# EAGLE design DoE Receiver v1_16 (EAGLE 9.5.2)
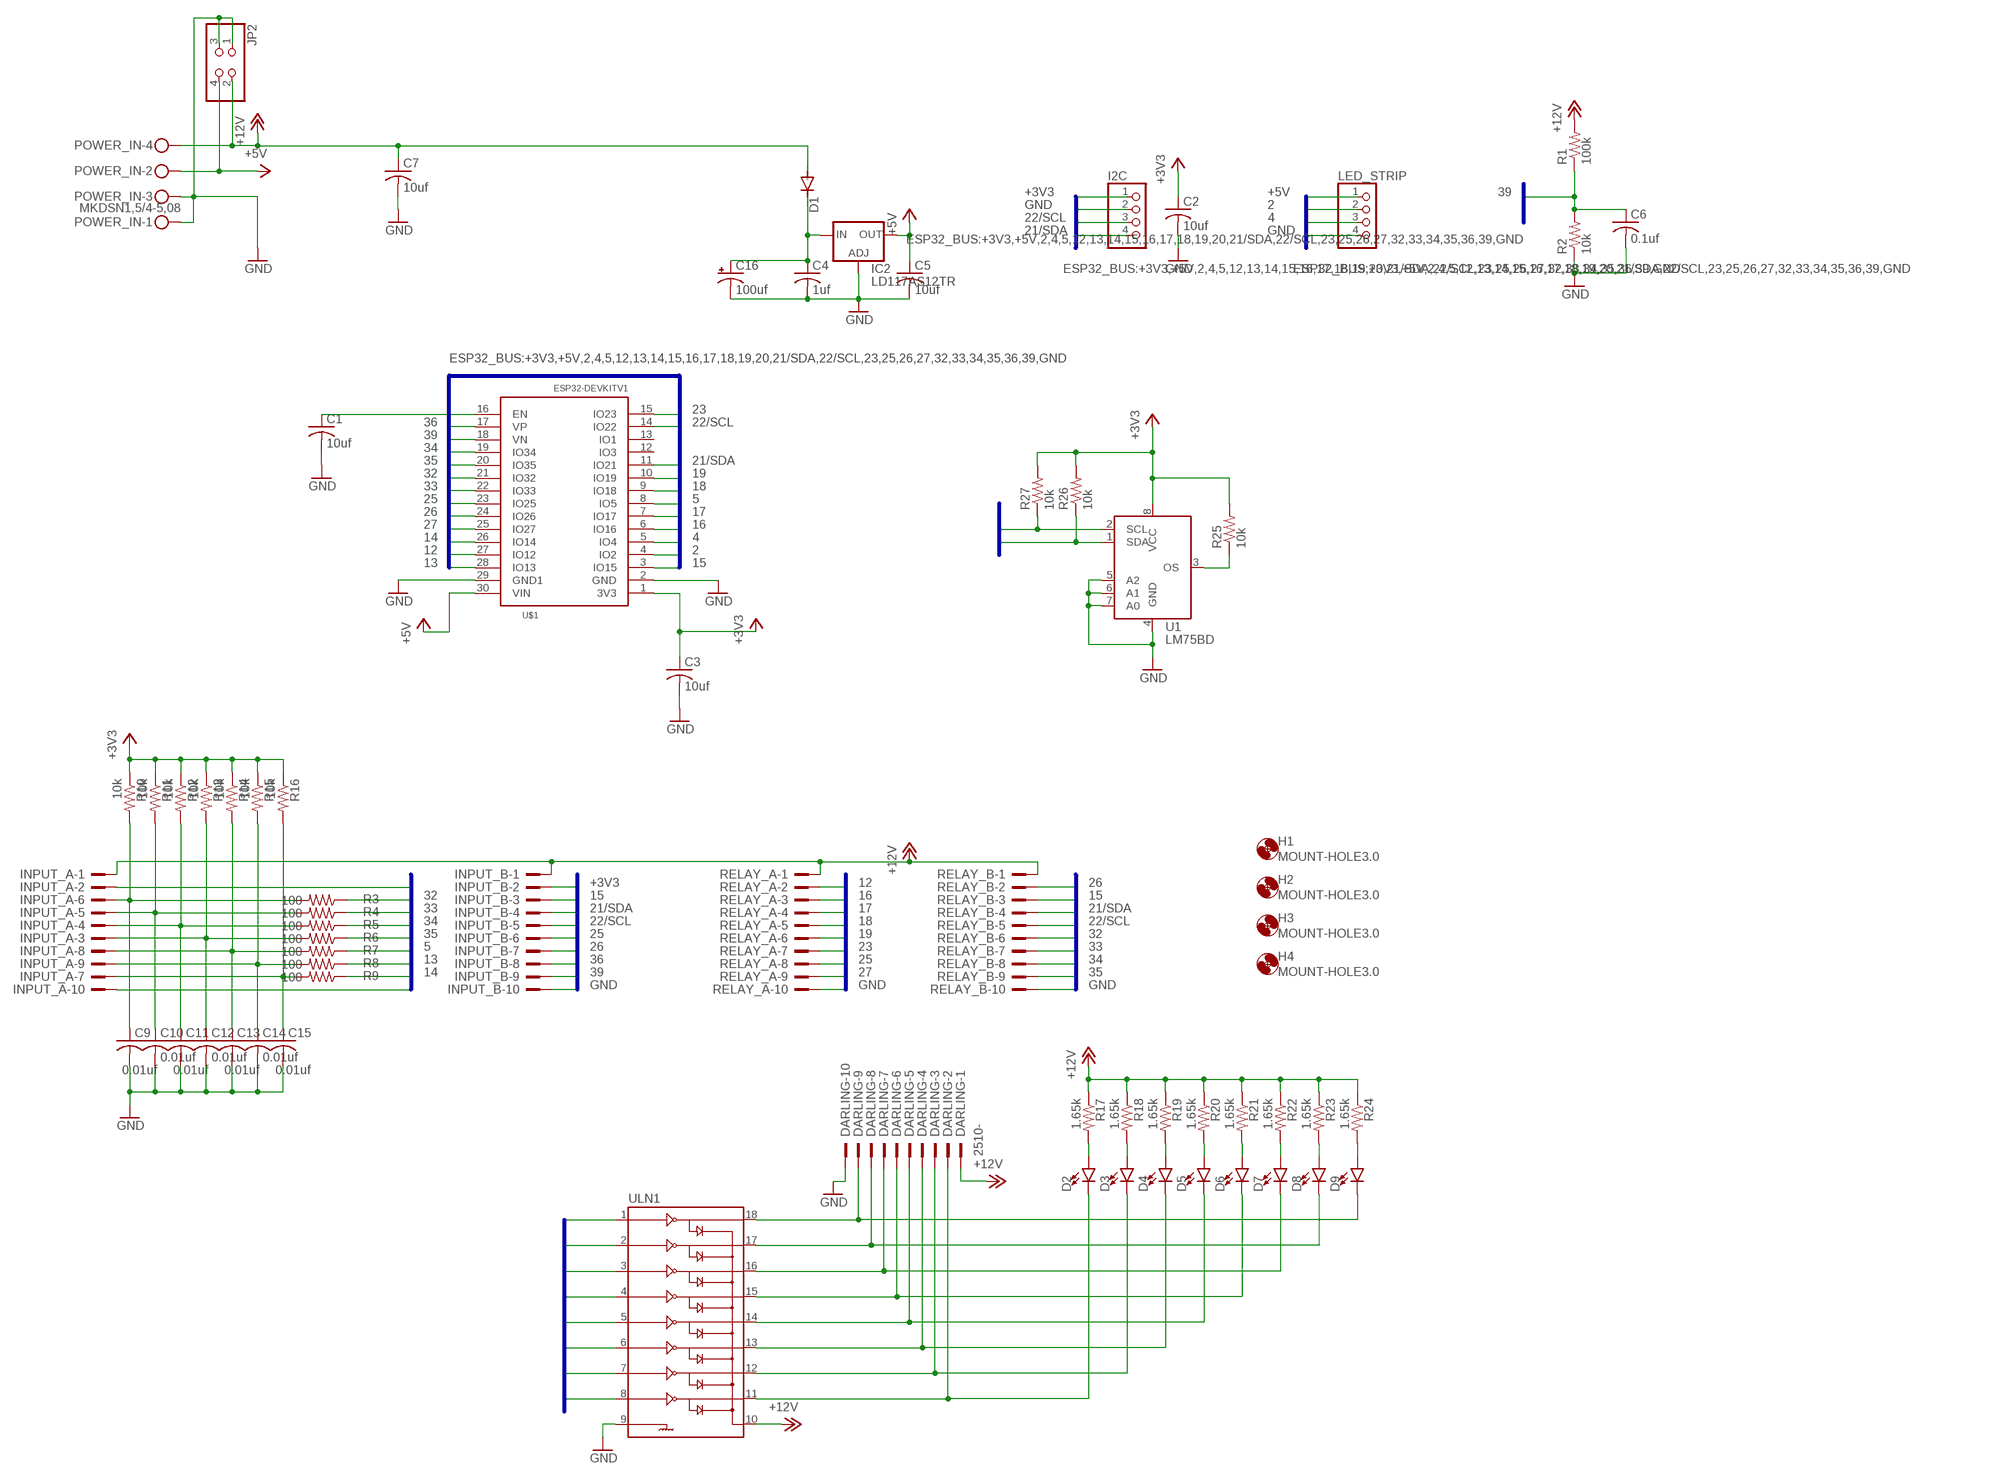
[diagram p0: schematic, sheet 1]

## Parts
C1  10uf  C-USC0603  [C0603]
C2  10uf  C-USC0603  [C0603]
C3  10uf  C-USC0603  [C0603]
C4  1uf  C-USC0805  [C0805]
C5  10uf  C-USC0603  [C0603]
C6  0.1uf  C-USC0603  [C0603]
C7  10uf  C-USC0805  [C0805]
C9  0.01uf  C-USC0603  [C0603]
C10  0.01uf  C-USC0603  [C0603]
C11  0.01uf  C-USC0603  [C0603]
C12  0.01uf  C-USC0603  [C0603]
C13  0.01uf  C-USC0603  [C0603]
C14  0.01uf  C-USC0603  [C0603]
C15  0.01uf  C-USC0603  [C0603]
C16  100uf  CPOL-US153CLV-0807  [153CLV-0807]
D1  DIODE-DO-214AC  [DO-214AC]
D2  LED0603  [LED-0603]
D3  LED0603  [LED-0603]
D4  LED0603  [LED-0603]
D5  LED0603  [LED-0603]
D6  LED0603  [LED-0603]
D7  LED0603  [LED-0603]
D8  LED0603  [LED-0603]
D9  LED0603  [LED-0603]
DARLING  2510-  [PAK100/2500-10]
H1  MOUNT-HOLE3.0  [3,0]
H2  MOUNT-HOLE3.0  [3,0]
H3  MOUNT-HOLE3.0  [3,0]
H4  MOUNT-HOLE3.0  [3,0]
I2C  PINHD-1X4  [1X04]
IC2  LD117AS12TR  [SOT223]
INPUT_A  2510-  [PAK100/2500-10]
INPUT_B  2510-  [PAK100/2500-10]
JP2  PINHD-2X2  [2X02]
LED_STRIP  PINHD-1X4/90  [1X04/90]
POWER_IN  MKDSN1,5/4-5,08  [MKDSN1,5/4-5,08]
R1  100k  R-US_R0603  [R0603]
R2  10k  R-US_R0603  [R0603]
R3  100  R-US_R0603  [R0603]
R4  100  R-US_R0603  [R0603]
R5  100  R-US_R0603  [R0603]
R6  100  R-US_R0603  [R0603]
R7  100  R-US_R0603  [R0603]
R8  100  R-US_R0603  [R0603]
R9  100  R-US_R0603  [R0603]
R10  10k  R-US_R0603  [R0603]
R11  10k  R-US_R0603  [R0603]
R12  10k  R-US_R0603  [R0603]
R13  10k  R-US_R0603  [R0603]
R14  10k  R-US_R0603  [R0603]
R15  10k  R-US_R0603  [R0603]
R16  10k  R-US_R0603  [R0603]
R17  1.65k  R-US_R0603  [R0603]
R18  1.65k  R-US_R0603  [R0603]
R19  1.65k  R-US_R0603  [R0603]
R20  1.65k  R-US_R0603  [R0603]
R21  1.65k  R-US_R0603  [R0603]
R22  1.65k  R-US_R0603  [R0603]
R23  1.65k  R-US_R0603  [R0603]
R24  1.65k  R-US_R0603  [R0603]
R25  10k  R-US_R0603  [R0603]
R26  10k  R-US_R0603  [R0603]
R27  10k  R-US_R0603  [R0603]
RELAY_A  2510-  [PAK100/2500-10]
RELAY_B  2510-  [PAK100/2500-10]
U1  LM75BD  [SOT96-1]
U$1  ESP32DEVKITV1  [ESP32-DEVKITV1]
ULN1  ULN2803SOIC  [SO018]

## Nets
2: LED_STRIP.2 U$1.4(IO2)
4: LED_STRIP.3 U$1.5(IO4)
5: R7.1 U$1.8(IO5)
12: RELAY_A.2 U$1.27(IO12) ULN1.8
13: R8.1 U$1.28(IO13)
14: R9.1 U$1.26(IO14)
15: INPUT_B.3 RELAY_B.3 U$1.3(IO15)
16: RELAY_A.3 U$1.6(IO16) ULN1.7
17: RELAY_A.4 U$1.7(IO17) ULN1.6
18: RELAY_A.5 U$1.9(IO18) ULN1.5
19: RELAY_A.6 U$1.10(IO19) ULN1.4
21/SDA: I2C.4 INPUT_B.4 R26.1 RELAY_B.4 U1.1(SDA) U$1.11(IO21)
22/SCL: I2C.3 INPUT_B.5 R27.1 RELAY_B.5 U1.2(SCL) U$1.14(IO22)
23: RELAY_A.7 U$1.15(IO23) ULN1.3
25: INPUT_B.6 RELAY_A.8 U$1.23(IO25) ULN1.2
26: INPUT_B.7 RELAY_B.2 U$1.24(IO26)
27: RELAY_A.9 U$1.25(IO27) ULN1.1
32: R3.1 RELAY_B.6 U$1.21(IO32)
33: R4.1 RELAY_B.7 U$1.22(IO33)
34: R5.1 RELAY_B.8 U$1.19(IO34)
35: R6.1 RELAY_B.9 U$1.20(IO35)
36: INPUT_B.8 U$1.17(VP)
39: C6.1 INPUT_B.9 R1.1 R2.2 U$1.18(VN)
+3V3 [3V3]: C2.1 C3.1 I2C.1 INPUT_A.2 INPUT_B.2 R10.1 R11.1 R12.1 R13.1 R14.1 R15.1 R16.1 R25.2 R26.2 R27.2 U1.8(VCC) U$1.1(3V3)
+5V [5V]: C5.1 IC2.4(OUT) JP2.4 LED_STRIP.1 POWER_IN.2 U$1.30(VIN)
+12V [12V]: C7.1 D1.A DARLING.1 INPUT_A.1 INPUT_B.1 JP2.2 POWER_IN.4 R1.2 R17.1 R18.1 R19.1 R20.1 R21.1 R22.1 R23.1 R24.1 RELAY_A.1 RELAY_B.1 ULN1.10
GND [GND]: C1.2 C2.2 C3.2 C4.2 C5.2 C6.2 C7.2 C9.2 C10.2 C11.2 C12.2 C13.2 C14.2 C15.2 C16.- DARLING.10 I2C.2 IC2.1(ADJ) INPUT_A.10 INPUT_B.10 JP2.1 JP2.3 LED_STRIP.4 POWER_IN.1 POWER_IN.3 R2.1 RELAY_A.10 RELAY_B.10 U1.4(GND) U1.5(A2) U1.6(A1) U1.7(A0) U$1.2(GND) U$1.29(GND1) ULN1.9
N$1: C1.1 U$1.16(EN)
N$2 [12V]: C4.1 C16.+ D1.C IC2.3(IN)
N$3: C9.1 INPUT_A.6 R3.2 R10.2
N$4: C10.1 INPUT_A.5 R4.2 R11.2
N$5: C11.1 INPUT_A.4 R5.2 R12.2
N$6: C12.1 INPUT_A.3 R6.2 R13.2
N$7: C13.1 INPUT_A.8 R7.2 R14.2
N$8: C14.1 INPUT_A.9 R8.2 R15.2
N$9: C15.1 INPUT_A.7 R9.2 R16.2
N$10: D9.C DARLING.9 ULN1.18
N$11: D8.C DARLING.8 ULN1.17
N$12: D7.C DARLING.7 ULN1.16
N$13: D6.C DARLING.6 ULN1.15
N$14: D5.C DARLING.5 ULN1.14
N$15: D4.C DARLING.4 ULN1.13
N$16: D3.C DARLING.3 ULN1.12
N$17: D2.C DARLING.2 ULN1.11
N$18: D2.A R17.2
N$19: D3.A R18.2
N$20: D4.A R19.2
N$21: D5.A R20.2
N$22: D6.A R21.2
N$23: D7.A R22.2
N$24: D8.A R23.2
N$25: D9.A R24.2
N$26: R25.1 U1.3(OS)
Unconnected: U$1.12(IO3) U$1.13(IO1)

## Buses
ESP32_BUS:+3V3,+5V,2,4,5,12,13,14,15,16,17,18,19,20,21/SDA,22/SCL,23,25,26,27,32,33,34,35,36,39,GND

## Library data of the parts
C1-C3 C5 C7 = rcl:C-US: CAPACITOR, American symbol; LCSC_PART_NUMBER: C19702; SPICEPREFIX: C
C4 = rcl:C-US: CAPACITOR, American symbol; LCSC_PART_NUMBER: C15849; SPICEPREFIX: C
C6 = rcl:C-US: CAPACITOR, American symbol; LCSC_PART_NUMBER: C14663; SPICEPREFIX: C
C9-C15 = rcl:C-US: CAPACITOR, American symbol; LCSC_PART_NUMBER: C57112; SPICEPREFIX: C
C16 = rcl:CPOL-US: POLARIZED CAPACITOR, American symbol; LCSC_PART_NUMBER: C249469; SPICEPREFIX: C
D1 = diode:DIODE-: DIODE; LCSC_PART_NUMBER: C95872
D2-D9 = SparkFun-LED:LED: LED (Generic) Standard schematic elements and footprints for 5mm, 3mm, 1206, and 0603 sized LEDs. Generic LEDs with no color specified.; LCSC_PART_NUMBER: C40378
DARLING INPUT_A INPUT_B RELAY_A RELAY_B = con-3m:2510-: 3M (TM) Pak 100 4-Wall Header Source: 3M; MF: 3M; MPN: 2510-6002UB; OC_FARNELL: 9838244; OC_NEWARK: 46F4725
H1-H4 = holes:MOUNT-HOLE: MOUNTING HOLE with drill center marker
I2C LED_STRIP = pinhead:PINHD-1X4: PIN HEADER
IC2 = v-reg:LD117A?*: Low drop fixed and adjustable positive voltage regulators 1 A Source: http://www.st.com/stonline/products/literature/ds/7194/ld1117axx.pdf; LCSC_PART_NUMBER: C6187; PRICE: 0.5
JP2 = pinhead:PINHD-2X2: PIN HEADER
POWER_IN = con-phoenix-508:MKDSN1,5/4-5,08: MKDSN 1,5/ 4-5,08 Printklemme Nennstrom: 13,5 A Nennspannung: 250 V Rastermaß: 5,08 mm Polzahl: 4 Anschlussart: Schraubanschluss Montage: Löten Anschlussrichtung Leiter/Platine: 0 ° Artikelnummer: 1729144 Source: http://eshop.phoenixcontact.com .. 1729144.pdf
R1 = rcl:R-US_: RESISTOR, American symbol; LCSC_PART_NUMBER: C25803; SPICEPREFIX: R
R2 R10-R16 R25-R27 = rcl:R-US_: RESISTOR, American symbol; LCSC_PART_NUMBER: C25804; SPICEPREFIX: R
R3-R9 = rcl:R-US_: RESISTOR, American symbol; LCSC_PART_NUMBER: C22775; SPICEPREFIX: R
R17-R24 = rcl:R-US_: RESISTOR, American symbol; LCSC_PART_NUMBER: C4177; SPICEPREFIX: R
U1 = nxp_60_1_1:LM75B: Digital temperature sensor and thermal watchdog AAL Eindhoven MK; LCSC_PART_NUMBER: C34565
U$1 = ESP32-DEVKITV1:ESP32DEVKITV1
ULN1 = SparkFun-PowerIC:ULN2803: Darlington Driver ULN2803 Darlington array. 500mA max per channel, 8-channel package. Spark Fun Electronics SKU : COM-00312; LCSC_PART_NUMBER: C9683

## Net classes
0 default: width 0.254 mm, clearance 0.203 mm
1 GND: width 0.508 mm, clearance 0.203 mm
2 12V: width 1.27 mm, clearance 0.254 mm
3 5V: width 0.635 mm, clearance 0.203 mm
4 3V3: width 0.305 mm, clearance 0.203 mm

## Board
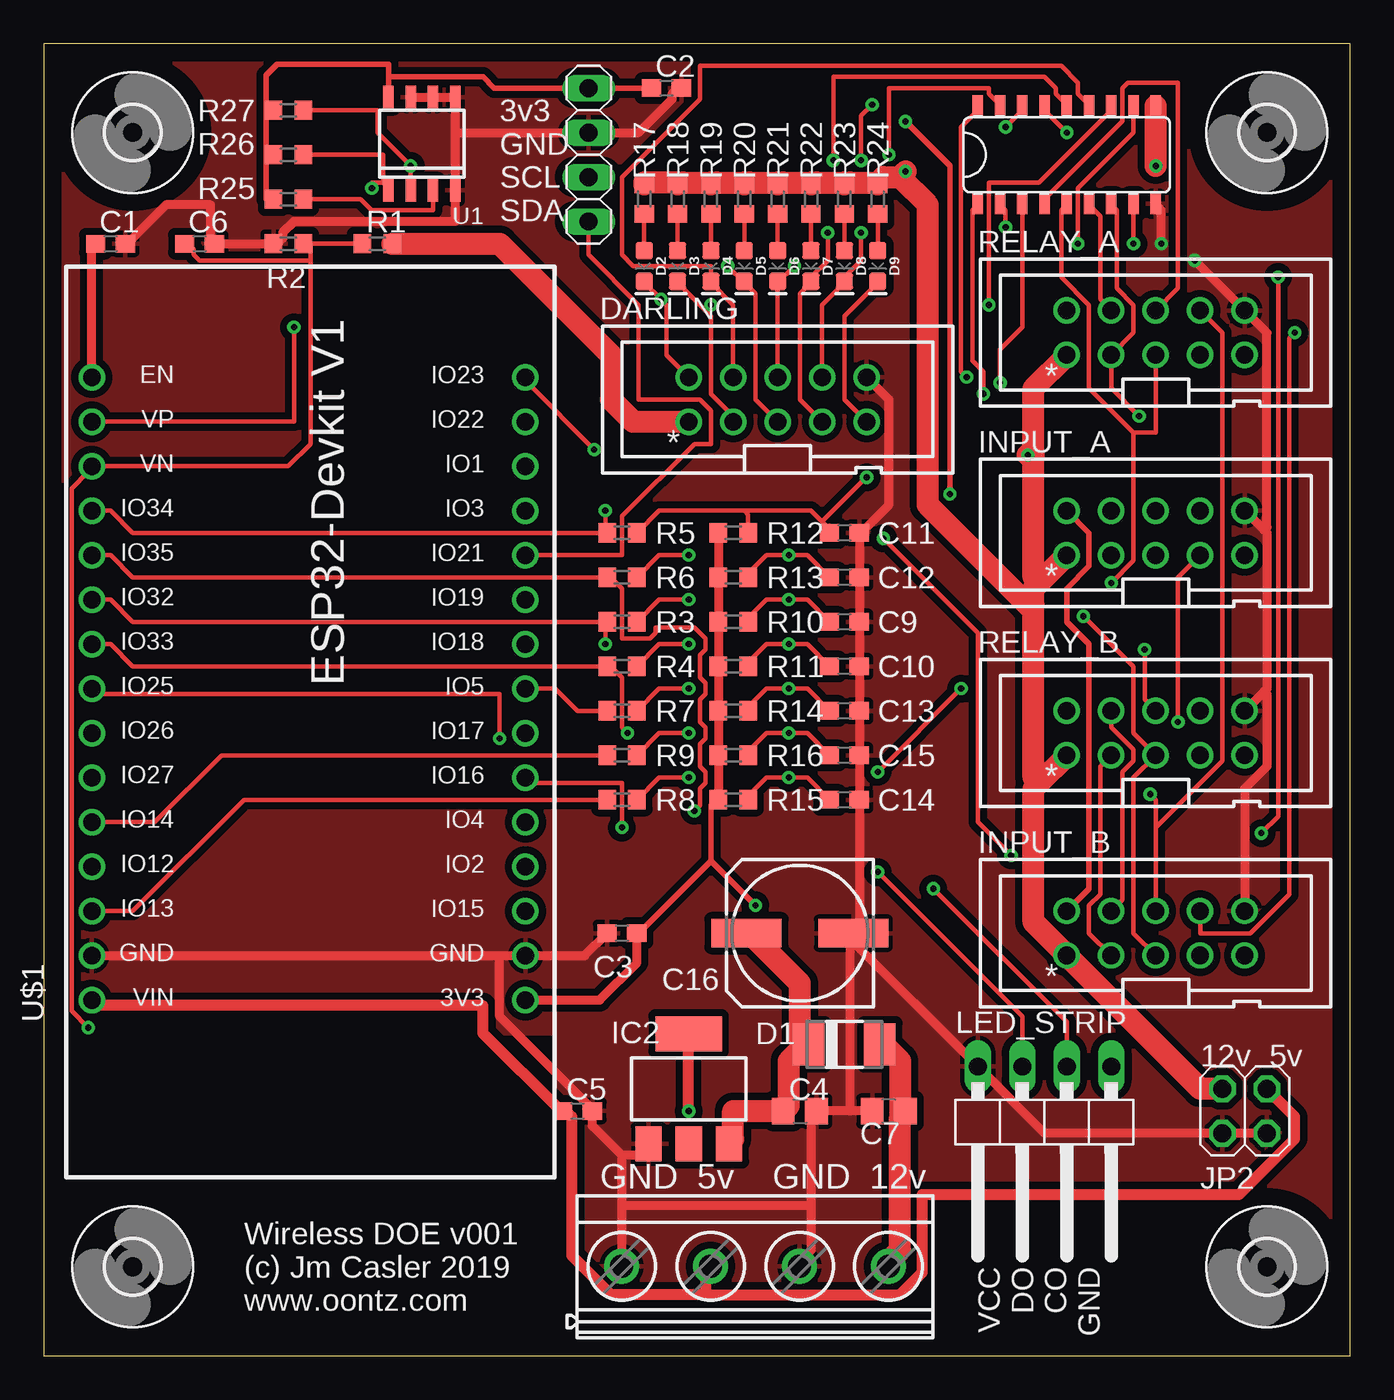
[diagram p1: board, top side]
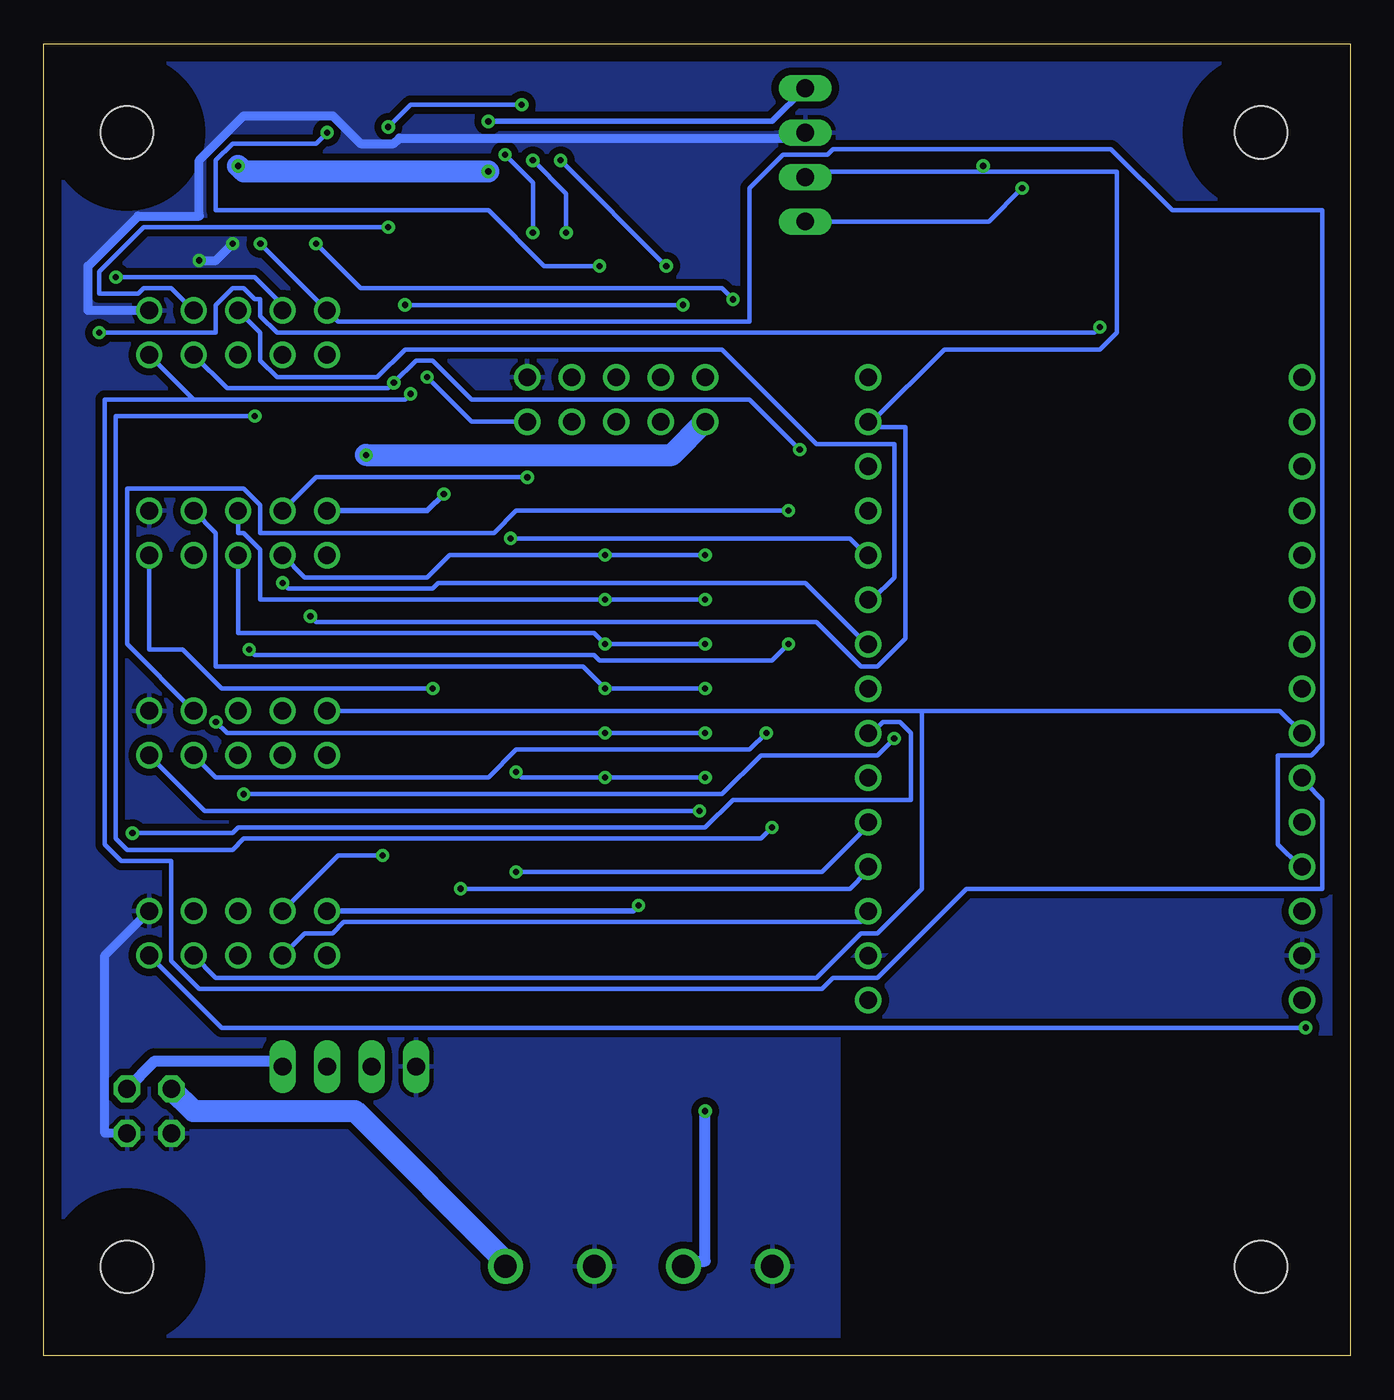
[diagram p2: board, bottom side, seen from below]

Size 74.6 x 74.92 mm. Coordinates in mm from the lower left corner, seen from the top.
Outline: 0,0 74.6,0 74.6,74.92 0,74.92 0,0
Copper layers (1*16): Top 0.035mm / dielectric 1.5mm / Bottom 0.035mm
Design rules "default *": minimum track width 6mil, minimum drill 0.35mm, track to track 6mil, track to pad 6mil, pad to pad 6mil, via to via 6mil, smd to smd 6mil, copper to edge 40mil, drill to drill 6mil, minimum pad ring 10mil, minimum via ring 8mil, stop-mask expansion 4mil, vias tented up to drill 20mil, thermal gap 10mil

### Footprints (pad centres in the part's own frame; a part is rotated, then mirrored left to right if it is on the bottom)
C0603 = smd 1.1 x 1: 1 -0.85,0; 2 0.85,0
C0805 = smd 1.3 x 1.5: 1 -0.95,0; 2 0.95,0
153CLV-0807 = smd 4 x 1.6: + 3.05,0; - -3.05,0
DO-214AC = smd 1.8 x 2.4: A 2.025,0; C -2.025,0
LED-0603 = smd 1 x 1: A -0.877,0; C 0.877,0
PAK100/2500-10 = drill 1 pad 1.422: 1 -5.08,-1.27; 2 -5.08,1.27; 3 -2.54,-1.27; 4 -2.54,1.27; 5 0,-1.27; 6 0,1.27; 7 2.54,-1.27; 8 2.54,1.27; 9 5.08,-1.27; 10 5.08,1.27
3,0 = hole 3: 0,0
1X04 = drill 1.016 long: 1 -3.81,0; 2 -1.27,0; 3 1.27,0; 4 3.81,0
SOT223 = smd 1.5 x 2: 1 -2.3,-3.15; 2 0,-3.15; 3 2.3,-3.15 | smd 3.8 x 2: 4 0,3.15
2X02 = drill 1.016 octagon: 1 -1.27,-1.27; 2 -1.27,1.27; 3 1.27,-1.27; 4 1.27,1.27
1X04/90 = drill 1.016 long: 1 -3.81,-3.81; 2 -1.27,-3.81; 3 1.27,-3.81; 4 3.81,-3.81
MKDSN1,5/4-5,08 = drill 1.3 pad 2: 1 -7.641,0.025; 2 -2.561,0.025; 3 2.519,0.025; 4 7.599,0.025
R0603 = smd 1 x 1.1: 1 -0.85,0; 2 0.85,0
SOT96-1 = smd 0.6 x 1.3: 1 -1.905,-2.65; 2 -0.635,-2.65; 3 0.635,-2.65; 4 1.905,-2.65; 5 1.905,2.65; 6 0.635,2.65; 7 -0.635,2.65; 8 -1.905,2.65
ESP32-DEVKITV1 = drill 1 pad 1.422: 1 -22.87,-13.54; 2 -20.33,-13.54; 3 -17.79,-13.54; 4 -15.25,-13.54; 5 -12.71,-13.54; 6 -10.17,-13.54; 7 -7.63,-13.54; 8 -5.09,-13.54; 9 -2.55,-13.54; 10 -0.01,-13.54; 11 2.53,-13.54; 12 5.07,-13.54; 13 7.61,-13.54; 14 10.15,-13.54; 15 12.69,-13.54; 16 12.69,11.23; 17 10.15,11.23; 18 7.61,11.23; 19 5.07,11.23; 20 2.53,11.23; 21 -0.01,11.23; 22 -2.55,11.23; 23 -5.09,11.23; 24 -7.63,11.23; 25 -10.17,11.23; 26 -12.71,11.23; 27 -15.25,11.23; 28 -17.79,11.23; 29 -20.33,11.23; 30 -22.87,11.23
SO018 = smd 0.6 x 1.2: 1 -5.08,-2.8; 2 -3.81,-2.8; 3 -2.54,-2.8; 4 -1.27,-2.8; 5 0,-2.8; 6 1.27,-2.8; 7 2.54,-2.8; 8 3.81,-2.8; 9 5.08,-2.8; 10 5.08,2.8; 11 3.81,2.8; 12 2.54,2.8; 13 1.27,2.8; 14 0,2.8; 15 -1.27,2.8; 16 -2.54,2.8; 17 -3.81,2.8; 18 -5.08,2.8

### Placement (x,y rotation side)
C1  3.81,63.5 0 top
C2  35.56,72.39 0 top
C3  33.02,24.13 180 top
C4  43.18,13.97 0 top
C5  30.48,13.97 0 top
C6  8.89,63.5 0 top
C7  48.26,13.97 180 top
C9  45.72,41.91 0 top
C10  45.72,39.37 0 top
C11  45.72,46.99 0 top
C12  45.72,44.45 0 top
C13  45.72,36.83 0 top
C14  45.72,31.75 0 top
C15  45.72,34.29 0 top
C16  43.18,24.13 180 top
D1  45.72,17.78 0 top
D2  34.29,62.23 270 top
D3  36.2,62.23 270 top
D4  38.1,62.23 270 top
D5  40.01,62.23 270 top
D6  41.91,62.23 270 top
D7  43.81,62.23 270 top
D8  45.72,62.23 270 top
D9  47.62,62.23 270 top
DARLING  41.91,54.61 0 top
H1  69.85,5.08 0 top
H2  69.85,69.85 0 top
H3  5.08,69.85 0 top
H4  5.08,5.08 0 top
I2C  31.11,68.58 270 top
IC2  36.83,15.24 0 top
INPUT_A  63.5,46.99 0 top
INPUT_B  63.5,24.13 0 top
JP2  68.58,13.97 0 top
LED_STRIP  57.15,12.7 180 top
POWER_IN  40.64,5.08 0 top
R1  19.05,63.5 0 top
R2  13.97,63.5 0 top
R3  33.02,41.91 0 top
R4  33.02,39.37 0 top
R5  33.02,46.99 0 top
R6  33.02,44.45 0 top
R7  33.02,36.83 0 top
R8  33.02,31.75 0 top
R9  33.02,34.29 0 top
R10  39.37,41.91 0 top
R11  39.37,39.37 0 top
R12  39.37,46.99 0 top
R13  39.37,44.45 0 top
R14  39.37,36.83 0 top
R15  39.37,31.75 0 top
R16  39.37,34.29 0 top
R17  34.29,66.04 270 top
R18  36.2,66.04 270 top
R19  38.1,66.04 270 top
R20  40.01,66.04 270 top
R21  41.91,66.04 270 top
R22  43.81,66.04 270 top
R23  45.72,66.04 270 top
R24  47.62,66.04 270 top
R25  13.97,66.04 180 top
R26  13.97,68.58 180 top
R27  13.97,71.12 180 top
RELAY_A  63.5,58.42 0 top
RELAY_B  63.5,35.56 0 top
U1  21.59,69.22 0 top
U$1  13.97,43.18 90 top
ULN1  58.42,68.58 0 top

### Tracks (layer width: path | path; a pad name or v marks a point on that pad's centre or on a via)
2  (via drill 0.35)
  Top 0.254: v50.8,26.67 58.42,19.05 LED_STRIP.2
  Bottom 0.254: v50.8,26.67 28.57,26.67 27.62,27.62 U$1.4
4  (via drill 0.35)
  Top 0.254: v47.62,27.62 55.88,19.37 LED_STRIP.3
  Bottom 0.254: v47.62,27.62 30.16,27.62 27.62,30.16 U$1.5
5
  Top 0.254: R7.1 30.48,36.83 29.21,38.1 U$1.8
12  (via drill 0.35)
  Top 0.254: v62.23,63.5 ULN1.8
  Bottom 0.254: v62.23,63.5 RELAY_A.2 57.78,59.05 34.29,59.05 34.29,66.67 32.38,68.58 29.84,68.58 29.53,68.9 13.65,68.9 10.16,65.41 1.59,65.41 1.59,34.92 2.22,34.29 4.13,34.29 4.13,29.21 2.86,27.94 U$1.27
13
  Top 0.254: R8.1 11.43,31.75 5.07,25.39 U$1.28
14
  Top 0.254: R9.1 10.16,34.29 6.34,30.47 U$1.26
15
  Top 0.254: RELAY_B.3 60.33,33.66 60.33,26.35 59.69,25.72 59.69,24.13 INPUT_B.3
  Bottom 0.254: INPUT_B.3 59.69,24.13 58.1,24.13 57.47,24.77 27.94,24.77 27.62,25.08 U$1.3
16  (via drill 0.35)
  Top 0.254: ULN1.7 60.96,65.72 61.28,65.41 61.28,60.96 62.23,60.01 62.23,58.42 RELAY_A.3 60.96,55.24 v62.55,53.66 | v33.02,30.16 33.02,32.7 27.62,32.7 U$1.6
  Bottom 0.254: v33.02,30.16 33.66,29.53 63.18,29.53 63.82,28.89 69.85,28.89 70.48,29.53 70.48,53.66 v62.55,53.66
17  (via drill 0.35)
  Top 0.254: RELAY_A.4 60.33,60.33 60.33,65.09 59.69,65.72 ULN1.6 | v69.53,29.84 70.48,30.8 v70.48,61.59
  Bottom 0.254: v69.53,29.84 63.82,29.84 63.5,30.16 36.83,30.16 35.24,31.75 25.08,31.75 25.08,35.56 25.72,36.2 26.67,36.2 27.3,35.56 U$1.7 | v70.48,61.59 62.55,61.59 60.96,60.01 RELAY_A.4
18  (via drill 0.35)
  Top 0.254: 62.23,52.7 59.69,55.24 59.69,60.01 58.1,61.59 58.1,65.41 58.42,65.72 ULN1.5 | 62.23,52.7 63.5,52.7 RELAY_A.5 | v60.96,44.13 62.23,45.4 62.23,52.7
  Bottom 0.254: v60.96,44.13 60.64,43.81 52.39,43.81 52.07,44.13 31.11,44.13 27.62,40.64 U$1.9
19
  Top 0.254: RELAY_A.6 64.77,60.96 64.77,72.71 61.91,72.71 61.59,72.39 61.59,70.48 57.15,66.04 ULN1.4
  Bottom 0.254: RELAY_A.6 62.23,58.42 62.23,56.83 61.28,55.88 55.56,55.88 53.98,57.47 35.88,57.47 30.48,52.07 26.04,52.07 26.04,44.45 27.3,43.18 U$1.10
21/SDA  (via drill 0.35)
  Top 0.254: INPUT_B.4 61.59,26.04 61.59,33.34 62.23,33.97 62.23,34.61 60.96,35.88 RELAY_B.4 | R26.1 19.37,68.58 19.37,66.99 | 19.37,66.99 19.68,66.67 U1.1 | I2C.4 31.11,62.87 33.97,60.01 33.97,54.61 37.47,54.61 38.1,53.98 38.1,52.07 37.15,52.07 33.02,47.94 33.02,45.72 27.62,45.72 U$1.11 | 19.37,66.99 18.73,66.99 v18.73,66.67 | v55.24,28.57 53.34,30.48 53.34,41.27 v47.94,46.67
  Bottom 0.254: v18.73,66.67 20.64,64.77 I2C.4 | INPUT_B.4 57.78,28.57 v55.24,28.57 | v47.94,46.67 28.57,46.67 27.62,45.72 U$1.11
22/SCL  (via drill 0.35)
  Top 0.254: INPUT_B.5 62.23,24.13 62.23,33.02 RELAY_B.5 62.23,35.56 62.23,39.37 v59.37,42.23 | R27.1 19.05,71.12 19.05,69.85 v20.95,67.94 U1.2
  Bottom 0.254: 20.95,67.63 30.8,67.63 I2C.3 | 20.95,67.63 13.34,67.63 13.34,58.42 14.29,57.47 23.18,57.47 27.3,53.34 U$1.14 27.3,53.02 25.4,53.02 25.4,40.96 26.99,39.37 27.94,39.37 30.48,41.91 59.05,41.91 v59.37,42.23 | 20.95,67.63 v20.95,67.94
23  (via drill 0.35)
  Top 0.254: ULN1.3 55.88,58.74 54.61,57.47 v54.61,55.56 | v31.43,51.75 27.62,55.56 U$1.15
  Bottom 0.254: RELAY_A.7 64.14,55.24 54.93,55.24 v54.61,55.56 53.34,56.83 52.39,56.83 50.16,54.61 34.29,54.61 v31.43,51.75
25  (via drill 0.35)
  Top 0.254: v54.93,64.45 54.93,65.41 54.61,65.72 ULN1.2 | v26.04,35.24 26.04,37.78 2.86,37.78 U$1.23 | v63.18,32.07 63.5,31.75 63.5,30.16 | INPUT_B.6 63.5,30.16 | RELAY_A.8 67.31,58.42 67.31,33.97 63.5,30.16
  Bottom 0.254: v54.93,64.45 68.9,64.45 71.44,61.91 71.44,60.64 69.22,60.64 68.9,60.96 67.31,60.96 RELAY_A.8 | v26.04,35.24 26.99,34.29 33.66,34.29 35.88,32.07 v63.18,32.07
26
  Bottom 0.254: RELAY_B.2 24.45,36.83 | 24.45,36.83 4.02,36.83 U$1.24 | INPUT_B.7 64.77,21.59 30.48,21.59 27.94,24.13 26.99,24.13 24.45,26.67 24.45,36.83
27  (via drill 0.35)
  Top 0.254: v53.66,54.93 53.66,56.2 53.02,56.83 53.02,65.41 53.34,65.72 ULN1.1
  Bottom 0.254: v53.66,54.93 53.98,54.61 66.04,54.61 | RELAY_A.9 66.04,54.61 | 66.04,54.61 71.12,54.61 71.12,29.21 70.17,28.26 67.31,28.26 67.31,22.54 65.72,20.95 30.16,20.95 29.53,21.59 26.99,21.59 21.91,26.67 1.59,26.67 1.59,31.75 2.54,32.7 U$1.25
32  (via drill 0.35)
  Top 0.254: U$1.21 3.82,43.17 5.08,41.91 32.07,41.91 | RELAY_B.6 62.87,37.47 v62.87,40.32 | 32.07,41.91 v32.07,40.64 | 32.07,41.91 R3.1
  Bottom 0.254: v62.87,40.32 62.55,40.01 43.18,40.01 42.86,39.69 33.02,39.69 v32.07,40.64
33  (via drill 0.35)
  Top 0.254: U$1.22 3.82,40.63 5.08,39.37 R4.1 32.38,39.37 33.02,38.73 33.02,35.88 v33.34,35.56
  Bottom 0.254: RELAY_B.7 64.77,33.02 49.21,33.02 47.62,34.61 34.29,34.61 v33.34,35.56
34  (via drill 0.35)
  Top 0.254: U$1.19 3.82,48.25 5.08,46.99 32.07,46.99 | 32.07,46.99 v32.07,48.26 | 32.07,46.99 R5.1
  Bottom 0.254: RELAY_B.8 69.85,40.64 69.85,49.53 63.18,49.53 62.23,48.58 62.23,46.99 48.9,46.99 47.62,48.26 v32.07,48.26
35  (via drill 0.35)
  Top 0.254: U$1.20 3.82,45.71 5.08,44.45 R6.1 32.38,44.45 33.02,43.81 33.02,40.96 34.61,40.96 34.92,41.27 34.92,41.59 37.15,41.59 37.78,40.96 37.78,40.32 37.47,40.01 37.47,38.73 37.78,38.42 37.78,37.78 37.47,37.47 37.47,36.2 37.78,35.88 37.78,35.24 37.47,34.92 37.47,33.66 37.78,33.34 37.78,32.7 37.47,32.38 37.47,31.43 v37.15,31.11
  Bottom 0.254: RELAY_B.9 65.41,31.11 v37.15,31.11
36  (via drill 0.35)
  Top 0.254: v14.29,58.74 14.29,53.34 2.86,53.34 U$1.17 | v71.44,58.42 71.12,58.1 71.12,26.35 68.9,24.13 66.04,24.13 INPUT_B.8
  Bottom 0.254: v14.29,58.74 14.61,58.42 61.28,58.42 62.23,59.37 62.23,60.33 62.55,60.33 63.18,60.96 63.82,60.96 64.77,60.01 64.77,58.42 v71.44,58.42
39  (via drill 0.35)
  Top 0.254: R2.2 15.24,63.5 | 15.24,63.5 R1.1 | 15.24,62.55 15.24,52.07 13.96,50.79 U$1.18 2.54,50.48 1.59,49.53 1.59,19.68 v2.54,18.73 | 15.24,62.55 15.24,63.5 | 15.24,62.55 8.89,62.55 8.57,62.87 8.57,63.18 8.26,63.5 C6.1
  Bottom 0.254: INPUT_B.9 64.45,18.73 v2.54,18.73
+3V3  (via drill 0.35)
  Top 0.305: 12.7,71.12 12.7,73.12 13.34,73.75 19.68,73.75 19.68,73.03 | 12.7,71.12 12.7,68.58 | 12.7,68.58 12.7,66.04 R25.2 | R26.2 12.7,68.58 | R27.2 12.7,71.12 | U1.8 19.68,73.03 | 38.42,34.29 R16.1 | 38.73,39.37 R11.1 | 38.42,36.83 R14.1 | 38.42,41.91 R10.1 | 38.42,44.45 R13.1 | 38.1,28.26 38.1,31.43 38.42,31.75 R15.1 | 38.1,28.26 33.97,24.13 C3.1 | v49.21,70.48 51.75,67.94 v51.75,49.21 | INPUT_B.2 59.69,26.67 59.69,40.64 58.42,41.91 58.42,43.81 59.69,45.09 59.69,46.99 INPUT_A.2 | v40.64,25.72 38.1,28.26 | C2.1 I2C.1 25.72,72.39 25.08,73.03 19.68,73.03
  Top 0.508: R12.1 R13.1 R10.1 R11.1 R14.1 R16.1 R15.1 | U$1.1 31.74,20.31 33.87,22.44 C3.1
  Bottom 0.305: I2C.1 33.02,70.48 v49.21,70.48 | v51.75,49.21 52.7,48.26 INPUT_A.2 | v40.64,25.72 40.96,25.4 INPUT_B.2
+5V  (via drill 0.35)
  Top 0.635: 37.78,3.49 32.38,3.49 30.16,5.71 30.16,13.65 29.84,13.97 C5.1 29.53,13.97 25.08,18.41 25.08,20 2.86,20 U$1.30 | 37.78,3.49 37.78,5.08 POWER_IN.2 | v36.83,13.97 IC2.4 | JP2.4 71.44,13.65 71.44,12.38 68.26,9.21 50.16,9.21 50.16,4.76 48.9,3.49 37.78,3.49
  Bottom 0.635: LED_STRIP.1 61.28,16.83 68.26,16.83 JP2.4 | v36.83,13.97 36.83,5.4 37.78,5.4 POWER_IN.2
+12V  (via drill 0.35)
  Top 1.27: R1.2 26.04,63.5 32.38,57.15 32.38,54.61 33.66,53.34 DARLING.1 | R17.1 34.29,66.99 36.2,66.99 R18.1 36.51,66.99 38.1,66.99 R19.1 38.42,66.99 40.01,66.99 R20.1 40.32,66.99 41.91,66.99 R21.1 42.23,66.99 43.81,66.99 R22.1 44.13,66.99 45.72,66.99 R23.1 46.04,66.99 47.62,66.99 R24.1 47.94,67.31 48.9,67.31 | v63.5,67.94 ULN1.10 | 48.9,67.31 v49.21,67.63 | D1.A 47.94,17.78 48.9,16.83 48.9,13.97 C7.1 48.9,13.65 48.9,6.03 48.26,5.4 POWER_IN.4 | JP2.2 66.04,15.24 INPUT_B.1 56.52,24.77 56.52,32.38 56.83,32.7 | 56.83,32.7 RELAY_B.1 | 56.83,44.13 56.52,43.81 56.52,42.86 | 56.83,44.13 INPUT_A.1 | 56.52,42.86 56.52,33.02 56.83,32.7 | RELAY_A.1 56.52,55.24 56.52,51.44 | 56.52,51.44 56.52,44.45 56.83,44.13 | v56.2,51.44 56.52,51.44 | 48.9,67.31 50.48,65.72 50.48,48.58 56.2,42.86 56.52,42.86
  Bottom 1.27: v63.5,67.94 63.18,67.63 v49.21,67.63 | JP2.2 66.04,13.97 56.83,13.97 48.26,5.4 POWER_IN.4 | DARLING.1 38.73,51.44 v56.2,51.44
GND  (via drill 0.35)
  Top 0.508: C12.2 C11.2 46.67,46.99 48.26,48.58 48.26,54.61 DARLING.10 | C12.2 C9.2 | C9.2 C10.2 | C10.2 C13.2 | C13.2 C15.2 | C15.2 C14.2 46.57,24.47 C16.- | U$1.29 26.04,22.85 | 26.04,22.85 U$1.2 30.89,22.85 C3.2 | 34.29,11.85 IC2.1 33.87,11.43 33.02,11.43 | 33.02,11.43 31.33,13.12 C5.2 31.11,13.97 31.11,14.29 26.04,19.37 26.04,22.85 | C7.2 46.04,13.97 | 46.04,13.97 C4.2 43.81,13.97 43.81,8.57 | U1.7 U1.6 U1.5 23.5,69.85 | 33.02,8.57 33.02,5.4 POWER_IN.1 | 33.02,8.57 33.02,11.43 | 46.67,34.29 C15.2 | 46.67,39.37 C10.2 | 46.67,36.83 C13.2 | 46.67,41.91 C9.2 | 46.67,44.45 C12.2 | 46.04,23.81 46.04,24.13 C16.- | 46.04,23.81 46.04,13.97 | 46.04,23.81 LED_STRIP.4 57.15,12.7 JP2.1 JP2.3 | 46.04,23.81 C16.- | 43.81,8.57 43.81,6.03 43.18,5.4 POWER_IN.3 | 43.81,8.57 33.02,8.57 | 26.04,22.86 26.04,22.85 | C1.2 4.76,63.5 6.99,65.72 9.53,65.72 9.53,63.5 C6.2 R2.1 13.34,63.5 13.65,63.82 13.65,64.14 14.29,64.77 23.5,64.77 U1.4 23.5,69.85 | v63.82,63.5 63.82,65.41 63.5,65.72 ULN1.9 | v65.72,62.55 RELAY_A.10 69.85,58.42 69.85,47.31 69.69,47.15 | 69.69,37.94 69.85,38.1 69.85,46.99 69.69,47.15 | 69.69,37.94 RELAY_B.10 | INPUT_A.10 69.69,47.15 | INPUT_B.10 68.58,32.38 69.85,33.66 69.85,37.78 69.69,37.94 | C2.2 36.2,72.39 35.88,72.07 35.88,71.75 33.97,69.85 I2C.2 23.5,69.85
  Bottom 0.508: INPUT_B.10 71.12,22.86 71.12,12.7 JP2.3 | v63.82,63.5 64.77,62.55 v65.72,62.55 | I2C.2 31.43,69.53 54.29,69.53 54.61,69.22 56.52,69.22 58.1,70.8 63.18,70.8 65.72,68.26 65.72,65.09 69.22,65.09 72.07,62.23 72.07,59.69 RELAY_A.10
  pour Top (isolate 0.406): -0.64,75.56 74.93,75.56 74.93,-0.64 29.21,-0.64 29.21,18.41 -0.64,18.41
  pour Bottom (isolate 0.406): -1.27,76.2 75.56,76.2 75.56,-1.27 29.21,-1.27 29.21,18.41 -1.27,18.41
N$1
  Top 0.508: U$1.16 2.74,63.28 C1.1
N$2
  Top 1.27: IC2.3 39.37,12.38 39.37,13.97 C4.1 42.55,14.29 42.55,16.83 43.5,17.78 D1.C 43.18,18.1 43.18,21.27 40.32,24.13 C16.+
N$3  (via drill 0.35)
  Top 0.254: R3.2 35.14,43.18 v36.83,43.18 | C9.1 43.6,43.18 v42.55,43.18 41.27,43.18 40.22,42.12 R10.2
  Bottom 0.254: v36.83,43.18 v42.55,43.18 62.23,43.18 62.23,46.04 63.18,46.99 63.5,46.99 INPUT_A.6
N$4  (via drill 0.35)
  Top 0.254: R4.2 35.14,40.64 v36.83,40.64 | C10.1 43.6,40.64 v42.55,40.64 41.27,40.64 40.22,39.59 R11.2
  Bottom 0.254: v36.83,40.64 v42.55,40.64 43.18,41.27 63.5,41.27 INPUT_A.5
N$5  (via drill 0.35)
  Top 0.254: R5.2 35.14,48.26 40.01,48.26 | 44.45,47.62 43.81,48.26 40.01,48.26 | 44.45,47.62 44.87,47.2 C11.1 44.87,47.41 | R12.2 40.22,48.05 40.01,48.26 | 44.45,47.62 v46.99,50.16
  Bottom 0.254: INPUT_A.4 59.05,50.16 v46.99,50.16
N$6  (via drill 0.35)
  Top 0.254: R6.2 35.14,45.72 v36.83,45.72 | C12.1 43.6,45.72 v42.55,45.72 41.27,45.72 40.22,44.66 R13.2
  Bottom 0.254: v36.83,45.72 v42.55,45.72 51.44,45.72 52.7,44.45 59.69,44.45 INPUT_A.3
N$7  (via drill 0.35)
  Top 0.254: R7.2 35.14,38.1 v36.83,38.1 | C13.1 43.6,38.1 v42.55,38.1 41.27,38.1 40.22,37.05 R14.2
  Bottom 0.254: v36.83,38.1 v42.55,38.1 43.81,39.37 64.77,39.37 64.77,46.99 INPUT_A.8
N$8  (via drill 0.35)
  Top 0.254: 44.87,31.54 C14.1 43.6,33.02 v42.55,33.02 41.27,33.02 40.22,31.96 R15.2 | R8.2 35.14,33.02 v36.83,33.02 | v47.62,33.34 v52.39,38.1
  Bottom 0.254: v36.83,33.02 v42.55,33.02 47.31,33.02 v47.62,33.34 | INPUT_A.9 68.58,40.32 66.67,40.32 64.45,38.1 v52.39,38.1
N$9  (via drill 0.35)
  Top 0.254: R9.2 35.14,35.56 v36.83,35.56 | C15.1 43.6,35.56 v42.55,35.56 41.27,35.56 40.22,34.51 R16.2 | INPUT_A.7 64.77,44.45 v64.77,36.2
  Bottom 0.254: v36.83,35.56 v42.55,35.56 64.14,35.56 v64.77,36.2
N$10  (via drill 0.35)
  Top 0.254: DARLING.9 45.72,54.61 45.72,59.37 47.62,61.28 D9.C | v52.7,55.88 52.39,56.2 52.39,70.17 53.34,71.12 ULN1.18
  Bottom 0.254: v52.7,55.88 50.16,53.34 DARLING.9
N$11  (via drill 0.35)
  Top 0.254: DARLING.8 44.45,60.01 45.72,61.28 D8.C 45.72,61.59 46.67,62.55 v46.67,64.14 | v48.26,68.58 48.26,72.39 53.98,72.39 53.98,72.07 54.61,71.44 ULN1.17
  Bottom 0.254: v48.26,68.58 46.67,66.99 v46.67,64.14
N$12  (via drill 0.35)
  Top 0.254: DARLING.7 43.18,54.61 43.18,60.64 43.81,61.28 D7.C 43.81,61.59 44.77,62.55 v44.77,64.14 | v54.93,70.17 55.88,71.12 ULN1.16 | v47.31,71.44 46.67,70.8 v46.67,68.26
  Bottom 0.254: v54.93,70.17 53.66,71.44 v47.31,71.44 | v46.67,68.26 44.77,66.36 v44.77,64.14
N$13  (via drill 0.35)
  Top 0.254: DARLING.6 41.91,61.28 | v58.42,69.85 57.15,71.12 ULN1.15 | 41.91,61.28 v42.86,62.23 | 41.91,61.28 D6.C
  Bottom 0.254: v58.42,69.85 59.05,69.22 63.82,69.22 64.77,68.26 64.77,65.41 49.21,65.41 46.04,62.23 v42.86,62.23
N$14  (via drill 0.35)
  Top 0.254: 40.01,61.28 40.64,60.64 40.64,54.61 DARLING.5 | v45.09,68.26 45.09,73.03 57.15,73.03 57.78,72.39 57.78,72.07 58.42,71.44 ULN1.14 | 40.01,61.28 v39.05,62.23 | 40.01,61.28 D5.C
  Bottom 0.254: v39.05,62.23 v45.09,68.26
N$15
  Top 0.254: DARLING.4 39.37,60.01 38.1,61.28 D4.C 38.1,62.23 33.66,62.23 33.02,62.87 33.02,67.31 37.47,71.75 37.47,73.66 58.1,73.66 59.05,72.71 59.05,72.07 59.69,71.44 ULN1.13
N$16  (via drill 0.35)
  Top 0.254: 37.78,59.69 38.1,59.37 38.1,54.93 39.37,53.66 DARLING.3 | 37.78,59.69 36.2,61.28 D3.C | v53.98,60.01 53.98,66.99 56.83,66.99 60.96,71.12 ULN1.12 | 37.78,59.69 v38.1,60.01
  Bottom 0.254: v38.1,60.01 v53.98,60.01
N$17  (via drill 0.35)
  Top 0.254: DARLING.2 35.56,57.15 35.56,60.01 v35.24,60.33 34.29,61.28 D2.C | ULN1.11 62.23,69.85 59.05,66.67 v59.05,63.5
  Bottom 0.254: v59.05,63.5 56.52,60.96 35.88,60.96 v35.24,60.33
N$18
  Top 0.254: R17.2 D2.A
N$19
  Top 0.254: R18.2 D3.A
N$20
  Top 0.254: R19.2 D4.A
N$21
  Top 0.254: R20.2 D5.A
N$22
  Top 0.254: R21.2 D6.A
N$23
  Top 0.254: R22.2 D7.A
N$24
  Top 0.254: R23.2 D8.A
N$25
  Top 0.254: R24.2 D9.A
N$26
  Top 0.254: R25.1 18.1,66.04 18.73,65.41 22.23,65.41 U1.3

### Text on the board
tPlace: 3v3 / GND / SCL / SDA | * | * | * | * | * | GND 5v GND 12v | VCC / DO / CO / GND
tNames: 12v 5v | Wireless DOE v001 / (c) Jm Casler 2019 / www.oontz.com
tValues: *